# EAGLE design Bootloader_Board (EAGLE 7.6.0)
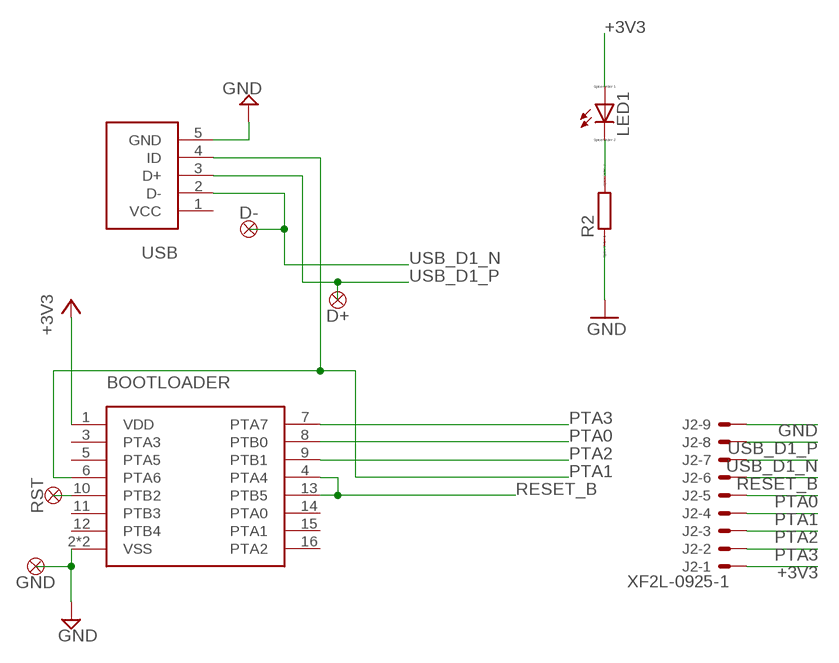
[diagram p0: schematic, sheet 1]

## Parts
BOOTLOADER  MKL02Z32CORRECT  [QFN16]
D+  TESTPAD  [TESTPAD]
D-  TESTPAD  [TESTPAD]
GND  TESTPAD  [TESTPAD]
J2  XF2L-0925-1  [XF2L-0925-1]
LED1  LED_ESML0603  [LED_SML0603]
R2  RR0603  [R0603]
RST  TESTPAD  [TESTPAD]
USB  10118194-0001LF  [10118194-0001LF]

## Nets
+3V3: BOOTLOADER.1(VDD) J2.1 LED1.A
GND: BOOTLOADER.2(VSS) BOOTLOADER.TH(VSS) GND.P$1 J2.9 R2.1 USB.5(GND)
N$12: BOOTLOADER.10(PTB2) RST.P$1
N$15: LED1.C R2.2
PTA0: BOOTLOADER.8(PTB0) J2.5
PTA1: BOOTLOADER.6(PTA6) J2.4 USB.4(ID)
PTA2: BOOTLOADER.9(PTB1) J2.3
PTA3: BOOTLOADER.7(PTA7) J2.2
RESET_B: BOOTLOADER.4(PTA4) BOOTLOADER.13(PTB5) J2.6
USB_D1_N [USB]: D-.P$1 J2.7 USB.2(D-)
USB_D1_P [USB]: D+.P$1 J2.8 USB.3(D+)
Unconnected: BOOTLOADER.3(PTA3) BOOTLOADER.5(PTA5) BOOTLOADER.11(PTB3) BOOTLOADER.12(PTB4) BOOTLOADER.14(PTA0) BOOTLOADER.15(PTA1) BOOTLOADER.16(PTA2) USB.1(VCC)

## Library data of the parts
BOOTLOADER = 445-eagle-lib:MKL02Z32
D+ D- GND RST = 445-eagle-lib:TESTPAD
J2 = con-omron:XF2*-09?: OMRON FPC Connector Source : http://www.omron.com/ecb/products/pdf/fpc.pdf; MPN: XF2L-0925-1A; OC_FARNELL: unknown; OC_NEWARK: 05M1991
LED1 = eagle-ltspice:LED_E: LED Source: http://www.osram.convergy.de Source: www.luxeon.com Source: www.kingbright.com; SPICEMODEL: NONE; SPICEPREFIX: D; SPICETYPE: diode
R2 = eagle-ltspice:R: RESISTOR, European symbol; SPICEMODEL: NONE; SPICEPREFIX: R
USB = 445-eagle-lib:10118194-0001LF

## Net classes
1 USB: width 0.333 mm, drill 0.333 mm, clearance 0.178 mm

## Board
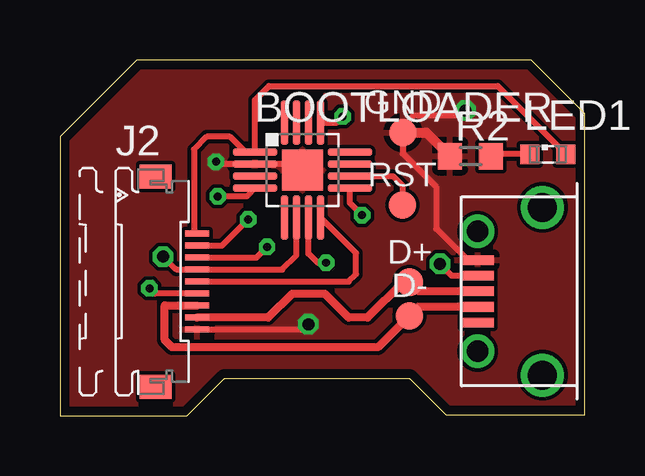
[diagram p1: board, top side]
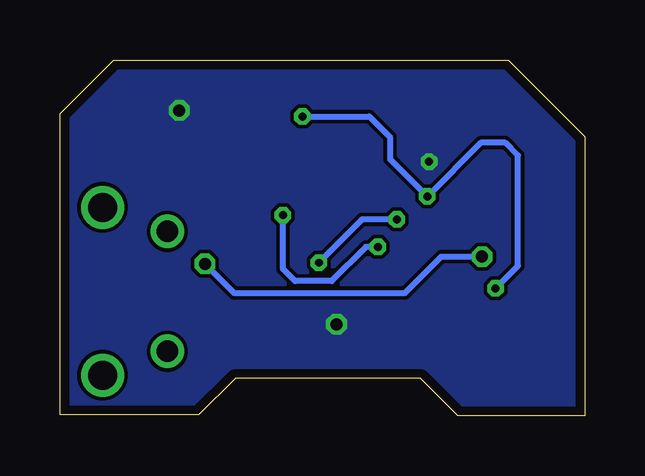
[diagram p2: board, bottom side, seen from below]

Size 21.89 x 14.83 mm. Coordinates in mm from the lower left corner, seen from the top.
Outline: 0,0 5.31,0 6.86,1.55 14.58,1.55 16.1,0.03 21.89,0.03 21.89,12.6 19.66,14.83 3.2,14.83 0,11.63 0,0
Copper layers (1*16): Top 0.0356mm / dielectric 1.5011mm / Bottom 0.0356mm
Design rules "LaenPCBOrder": minimum track width 6mil, minimum drill 13mil, track to track 6mil, track to pad 6mil, pad to pad 6mil, via to via 6mil, smd to smd 6mil, copper to edge 15mil, drill to drill 6mil, minimum pad ring 7mil, minimum via ring 7mil, stop-mask expansion 3mil, vias tented up to drill 0mil, thermal gap 10mil

### Footprints (pad centres in the part's own frame; a part is rotated, then mirrored left to right if it is on the bottom)
QFN16 = smd 1.85 x 0.3: 1 -1.975,0.75; 2 -1.975,0.25; 3 -1.975,-0.25; 4 -1.975,-0.75; 9 1.975,-0.75; 10 1.975,-0.25; 11 1.975,0.25; 12 1.975,0.75 | smd 0.3 x 1.85: 5 -0.75,-1.975; 6 -0.25,-1.975; 7 0.25,-1.975; 8 0.75,-1.975; 13 0.75,1.975; 14 0.25,1.975; 15 -0.25,1.975; 16 -0.75,1.975 | smd 1.7 x 1.7: TH 0,0
TESTPAD = smd 1.143 x 1.143: P$1 0,0
XF2L-0925-1 = smd 1 x 0.25: 1 1.905,2; 2 1.905,1.5; 3 1.905,1; 4 1.905,0.5; 5 1.905,0; 6 1.905,-0.5; 7 1.905,-1; 8 1.905,-1.5; 9 1.905,-2 | smd 1.34 x 1: M1 0.18,4.388; M2 0.18,-4.388
LED_SML0603 = smd 0.8 x 0.8: A 0.75,0; C -0.75,0
R0603 = smd 1 x 1.1: 1 -0.85,0; 2 0.85,0
10118194-0001LF = smd 0.4 x 1.35: 1 -1.3,2.7; 2 -0.65,2.7; 3 0,2.7; 4 0.65,2.7; 5 1.3,2.7 | drill 0.9 pad 1.4: P$6 -2.5,2.7; P$7 2.5,2.7 | drill 1.2: P$8 -3.5,0; P$9 3.5,0

### Placement (x,y rotation side)
BOOTLOADER  10.11,10.24 0 top
D+  14.58,5.56 0 top
D-  14.58,4.17 0 top
GND  14.3,11.81 0 top
J2  3.81,5.59 0 top
LED1  20.35,10.9 0 top
R2  17.12,10.82 0 top
RST  14.27,8.79 0 top
USB  20.12,5.18 90 top

### Tracks (layer width: path | path; a pad name or v marks a point on that pad's centre or on a via)
+3V3
  Top 0.254: J2.1 5.59,7.71 5.59,11.1 6.12,11.63 7.09,11.63 7.73,10.99 BOOTLOADER.1 8.13,13.16 8.71,13.74 18.25,13.74 LED1.A
GND  (via drill 0.33, 0.5)
  Top 0.254: 9.86,10.49 BOOTLOADER.TH 9.86,10.49 BOOTLOADER.2 6.61,10.49 v6.5,10.59 | USB.5 17.01,6.48 15.7,7.8 15.7,9.53 14.3,10.92 GND.P$1 14.3,12.06 14.76,12.52 16.71,12.52 v16.92,12.72 | J2.9 10.14,3.59 v10.36,3.81
  Top 0.406: GND.P$1 15.28,11.81 R2.1
  pour Bottom: 0,0 5.31,0 6.86,1.55 14.58,1.55 16.1,0.03 21.89,0.03 21.89,12.6 19.66,14.83 3.2,14.83 0,11.63
  pour Top: 0,0 5.31,0 6.86,1.55 14.58,1.55 16.1,0.03 21.89,0.03 21.89,12.06 21.89,12.6 19.66,14.83 3.2,14.83 0,11.63
N$12
  Top 0.254: BOOTLOADER.10 13.89,9.99 14.28,9.6 RST.P$1
N$15
  Top 0.254: LED1.C 18.05,10.9 R2.2
PTA0
  Top 0.254: J2.5 12.04,5.59 12.34,5.89 12.34,6.78 BOOTLOADER.8 10.85,8.25
PTA1  (via drill 0.5)
  Top 0.254: BOOTLOADER.6 9.86,6.68 9.26,6.09 J2.4 4.85,6.1 4.32,6.63 v4.29,6.63 | USB.4 16.34,5.83 v15.85,6.33
  Bottom 0.254: v15.85,6.33 14.63,5.11 7.52,5.11 5.99,6.63 v4.29,6.63
PTA2  (via drill 0.33)
  Top 0.254: J2.3 8.19,6.59 v8.64,7.04 | v12.6,8.36 12.08,8.87 BOOTLOADER.9
  Bottom 0.254: v8.64,7.04 9.14,7.04 10.57,5.61 12.09,5.61 12.6,6.12 v12.6,8.36
PTA3  (via drill 0.33)
  Top 0.254: J2.2 6.76,7.09 v7.85,8.18 | v11.1,6.38 10.74,6.38 10.36,6.76 BOOTLOADER.7
  Bottom 0.254: v7.85,8.18 9.3,8.18 v11.1,6.38
RESET_B  (via drill 0.33)
  Top 0.254: v3.73,5.31 3.95,5.09 J2.6 | BOOTLOADER.4 7.79,9.14 v6.58,9.14 | BOOTLOADER.13 11.53,12.21 v11.79,12.47
  Bottom 0.254: v3.73,5.31 2.79,6.25 2.79,10.85 3.33,11.38 4.34,11.38 v6.58,9.14 8.13,10.69 8.13,11.61 8.99,12.47 v11.79,12.47
USB_D1_N
  Top 0.333: USB.2 14.95,4.53 D-.P$1 13.26,2.85 4.67,2.85 4.37,3.15 4.37,4.6 4.38,4.59 J2.7
USB_D1_P
  Top 0.333: USB.3 14.96,5.18 D+.P$1 14.3,5.56 12.83,4.09 12.04,4.09 11.05,5.08 9.68,5.08 8.69,4.09 J2.8